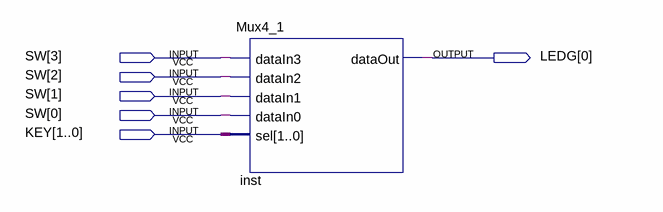
[diagram p0: schematic sheet]
// Quartus schematic Mux4_1Demo.bdf as structural Verilog: 1 symbols, 6 pins
module Mux4_1Demo (
  input  [3:0] SW,
  input  [1:0] KEY,
  output [0:0] LEDG
);

  Mux4_1 inst (.dataIn3(SW[3]), .dataIn2(SW[2]), .dataIn1(SW[1]), .dataIn0(SW[0]), .sel(KEY), .dataOut(LEDG[0]));
endmodule
